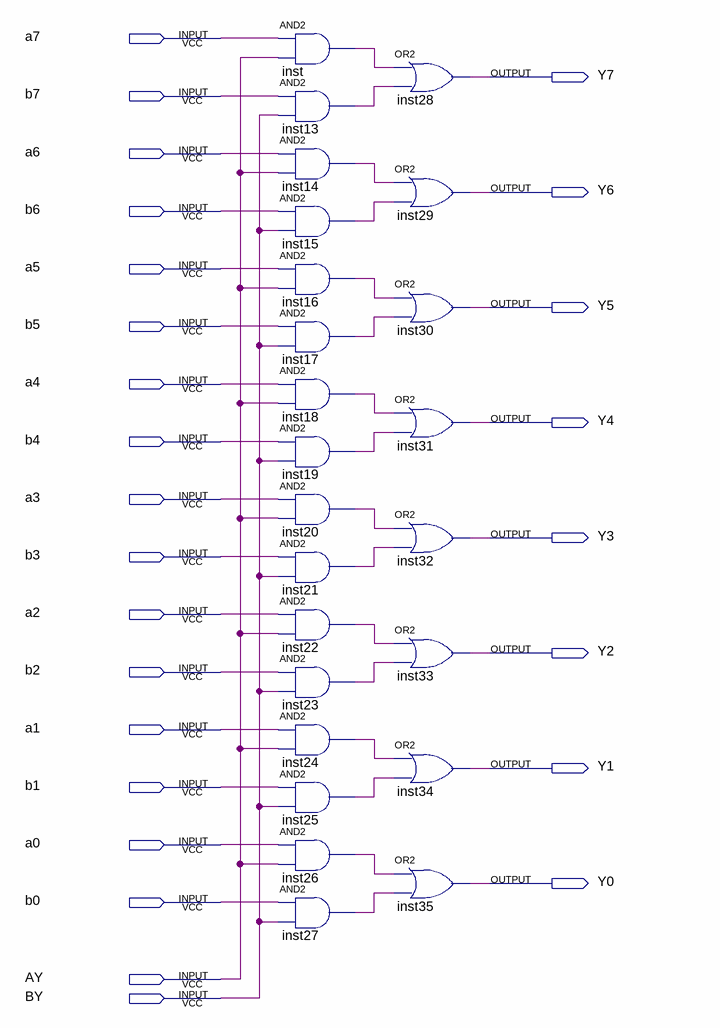
[diagram p0: schematic sheet]
// Quartus schematic Selector8.bdf as structural Verilog: 24 symbols, 26 pins
module Selector8 (
  input  a7,
  input  b7,
  input  a6,
  input  b6,
  input  a5,
  input  b5,
  input  a4,
  input  b4,
  input  a3,
  input  b3,
  input  a2,
  input  b2,
  input  a1,
  input  b1,
  input  a0,
  input  b0,
  input  AY,
  input  BY,
  output Y7,
  output Y6,
  output Y5,
  output Y4,
  output Y3,
  output Y2,
  output Y1,
  output Y0
);

  wire inst13_out, inst14_out, inst15_out, inst16_out, inst17_out, inst18_out, inst19_out, inst20_out,
       inst21_out, inst22_out, inst23_out, inst24_out, inst25_out, inst26_out, inst27_out, inst_out;

  and inst (inst_out, a7, AY);
  and inst13 (inst13_out, b7, BY);
  and inst14 (inst14_out, a6, AY);
  and inst15 (inst15_out, b6, BY);
  and inst16 (inst16_out, a5, AY);
  and inst17 (inst17_out, b5, BY);
  and inst18 (inst18_out, a4, AY);
  and inst19 (inst19_out, b4, BY);
  and inst20 (inst20_out, a3, AY);
  and inst21 (inst21_out, b3, BY);
  and inst22 (inst22_out, a2, AY);
  and inst23 (inst23_out, b2, BY);
  and inst24 (inst24_out, a1, AY);
  and inst25 (inst25_out, b1, BY);
  and inst26 (inst26_out, a0, AY);
  and inst27 (inst27_out, b0, BY);
  or inst28 (Y7, inst_out, inst13_out);
  or inst29 (Y6, inst14_out, inst15_out);
  or inst30 (Y5, inst16_out, inst17_out);
  or inst31 (Y4, inst18_out, inst19_out);
  or inst32 (Y3, inst20_out, inst21_out);
  or inst33 (Y2, inst22_out, inst23_out);
  or inst34 (Y1, inst24_out, inst25_out);
  or inst35 (Y0, inst26_out, inst27_out);
endmodule
